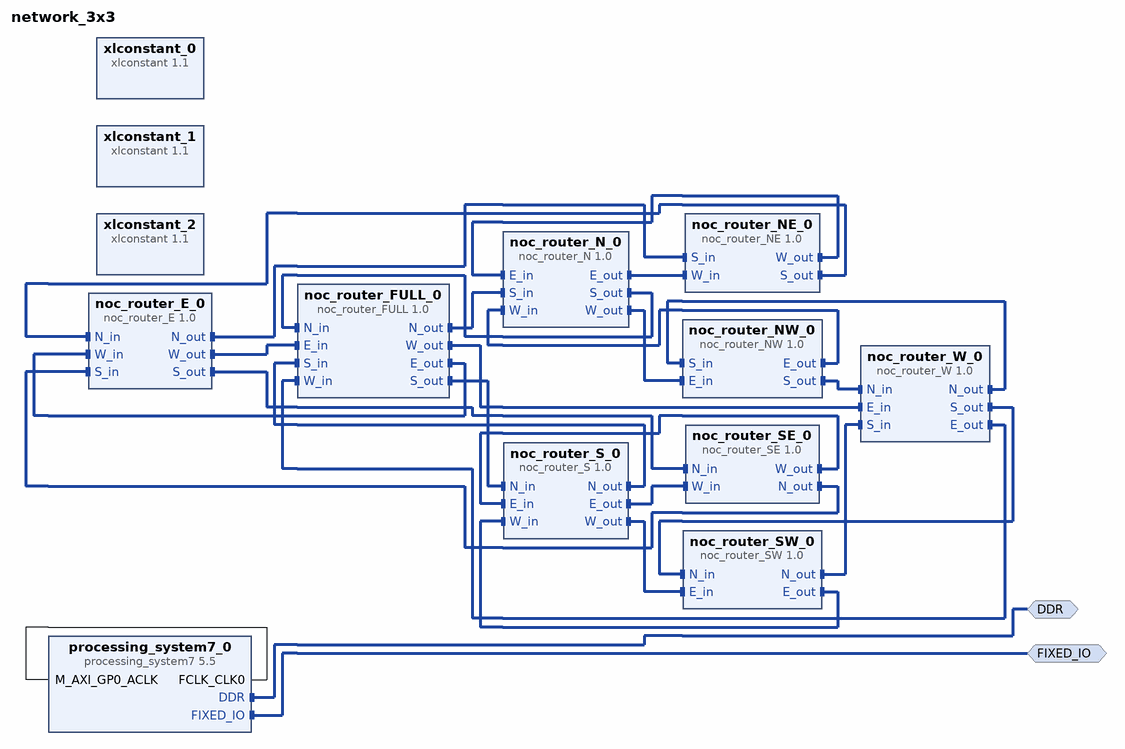
[diagram p0: block diagram of the top level]
# Vivado block design network_3x3, Vivado 2015.1
create_bd_design network_3x3

create_bd_intf_port -mode Master -vlnv xilinx.com:interface:ddrx_rtl:1.0 DDR
create_bd_intf_port -mode Master -vlnv xilinx.com:display_processing_system7:fixedio_rtl:1.0 FIXED_IO

create_bd_cell -type ip -vlnv xilinx.com:ip:processing_system7:5.5 processing_system7_0
set_property -dict {CONFIG.preset ZedBoard} [get_bd_cells processing_system7_0]
create_bd_cell -type ip -vlnv ttu.ee:user:noc_router_E:1.0 noc_router_E_0
create_bd_cell -type ip -vlnv ttu.ee:user:noc_router_FULL:1.0 noc_router_FULL_0
create_bd_cell -type ip -vlnv ttu.ee:user:noc_router_N:1.0 noc_router_N_0
create_bd_cell -type ip -vlnv ttu.ee:user:noc_router_NE:1.0 noc_router_NE_0
create_bd_cell -type ip -vlnv ttu.ee:user:noc_router_NW:1.0 noc_router_NW_0
create_bd_cell -type ip -vlnv ttu.ee:user:noc_router_S:1.0 noc_router_S_0
create_bd_cell -type ip -vlnv ttu.ee:user:noc_router_SE:1.0 noc_router_SE_0
create_bd_cell -type ip -vlnv ttu.ee:user:noc_router_SW:1.0 noc_router_SW_0
create_bd_cell -type ip -vlnv ttu.ee:user:noc_router_W:1.0 noc_router_W_0
create_bd_cell -type ip -vlnv xilinx.com:ip:xlconstant:1.1 xlconstant_0
set_property -dict {CONFIG.CONST_WIDTH 8 CONFIG.CONST_VAL 60} [get_bd_cells xlconstant_0]
create_bd_cell -type ip -vlnv xilinx.com:ip:xlconstant:1.1 xlconstant_1
set_property -dict {CONFIG.CONST_WIDTH 4 CONFIG.CONST_VAL 10} [get_bd_cells xlconstant_1]
create_bd_cell -type ip -vlnv xilinx.com:ip:xlconstant:1.1 xlconstant_2
set_property -dict {CONFIG.CONST_WIDTH 2 CONFIG.CONST_VAL 0} [get_bd_cells xlconstant_2]

# ---- connections ----

connect_bd_intf_net [get_bd_intf_pins noc_router_NW_0/E_out] [get_bd_intf_pins noc_router_N_0/W_in]
connect_bd_intf_net [get_bd_intf_pins noc_router_NW_0/S_out] [get_bd_intf_pins noc_router_W_0/N_in]
connect_bd_intf_net [get_bd_intf_pins noc_router_N_0/W_out] [get_bd_intf_pins noc_router_NW_0/E_in]
connect_bd_intf_net [get_bd_intf_pins noc_router_N_0/S_out] [get_bd_intf_pins noc_router_FULL_0/N_in]
connect_bd_intf_net [get_bd_intf_pins noc_router_N_0/E_out] [get_bd_intf_pins noc_router_NE_0/W_in]
connect_bd_intf_net [get_bd_intf_pins noc_router_NE_0/W_out] [get_bd_intf_pins noc_router_N_0/E_in]
connect_bd_intf_net [get_bd_intf_pins noc_router_NE_0/S_out] [get_bd_intf_pins noc_router_E_0/N_in]
connect_bd_intf_net [get_bd_intf_pins noc_router_E_0/N_out] [get_bd_intf_pins noc_router_NE_0/S_in]
connect_bd_intf_net [get_bd_intf_pins noc_router_E_0/W_out] [get_bd_intf_pins noc_router_FULL_0/E_in]
connect_bd_intf_net [get_bd_intf_pins noc_router_E_0/S_out] [get_bd_intf_pins noc_router_SE_0/N_in]
connect_bd_intf_net [get_bd_intf_pins noc_router_SE_0/N_out] [get_bd_intf_pins noc_router_E_0/S_in]
connect_bd_intf_net [get_bd_intf_pins noc_router_SE_0/W_out] [get_bd_intf_pins noc_router_S_0/E_in]
connect_bd_intf_net [get_bd_intf_pins noc_router_S_0/E_out] [get_bd_intf_pins noc_router_SE_0/W_in]
connect_bd_intf_net [get_bd_intf_pins noc_router_S_0/W_out] [get_bd_intf_pins noc_router_SW_0/E_in]
connect_bd_intf_net [get_bd_intf_pins noc_router_S_0/N_out] [get_bd_intf_pins noc_router_FULL_0/S_in]
connect_bd_intf_net [get_bd_intf_pins noc_router_SW_0/E_out] [get_bd_intf_pins noc_router_S_0/W_in]
connect_bd_intf_net [get_bd_intf_pins noc_router_SW_0/N_out] [get_bd_intf_pins noc_router_W_0/S_in]
connect_bd_intf_net [get_bd_intf_pins noc_router_W_0/N_out] [get_bd_intf_pins noc_router_NW_0/S_in]
connect_bd_intf_net [get_bd_intf_pins noc_router_W_0/S_out] [get_bd_intf_pins noc_router_SW_0/N_in]
connect_bd_intf_net [get_bd_intf_pins noc_router_W_0/E_out] [get_bd_intf_pins noc_router_FULL_0/W_in]
connect_bd_intf_net [get_bd_intf_pins noc_router_FULL_0/N_out] [get_bd_intf_pins noc_router_N_0/S_in]
connect_bd_intf_net [get_bd_intf_pins noc_router_FULL_0/W_out] [get_bd_intf_pins noc_router_W_0/E_in]
connect_bd_intf_net [get_bd_intf_pins noc_router_FULL_0/S_out] [get_bd_intf_pins noc_router_S_0/N_in]
connect_bd_intf_net [get_bd_intf_pins noc_router_FULL_0/E_out] [get_bd_intf_pins noc_router_E_0/W_in]
connect_bd_intf_net [get_bd_intf_ports DDR] [get_bd_intf_pins processing_system7_0/DDR]
connect_bd_intf_net [get_bd_intf_ports FIXED_IO] [get_bd_intf_pins processing_system7_0/FIXED_IO]
connect_bd_net [get_bd_pins processing_system7_0/FCLK_CLK0] [get_bd_pins processing_system7_0/M_AXI_GP0_ACLK]

validate_bd_design
save_bd_design
